# Altium project HnWrist.PrjPcb
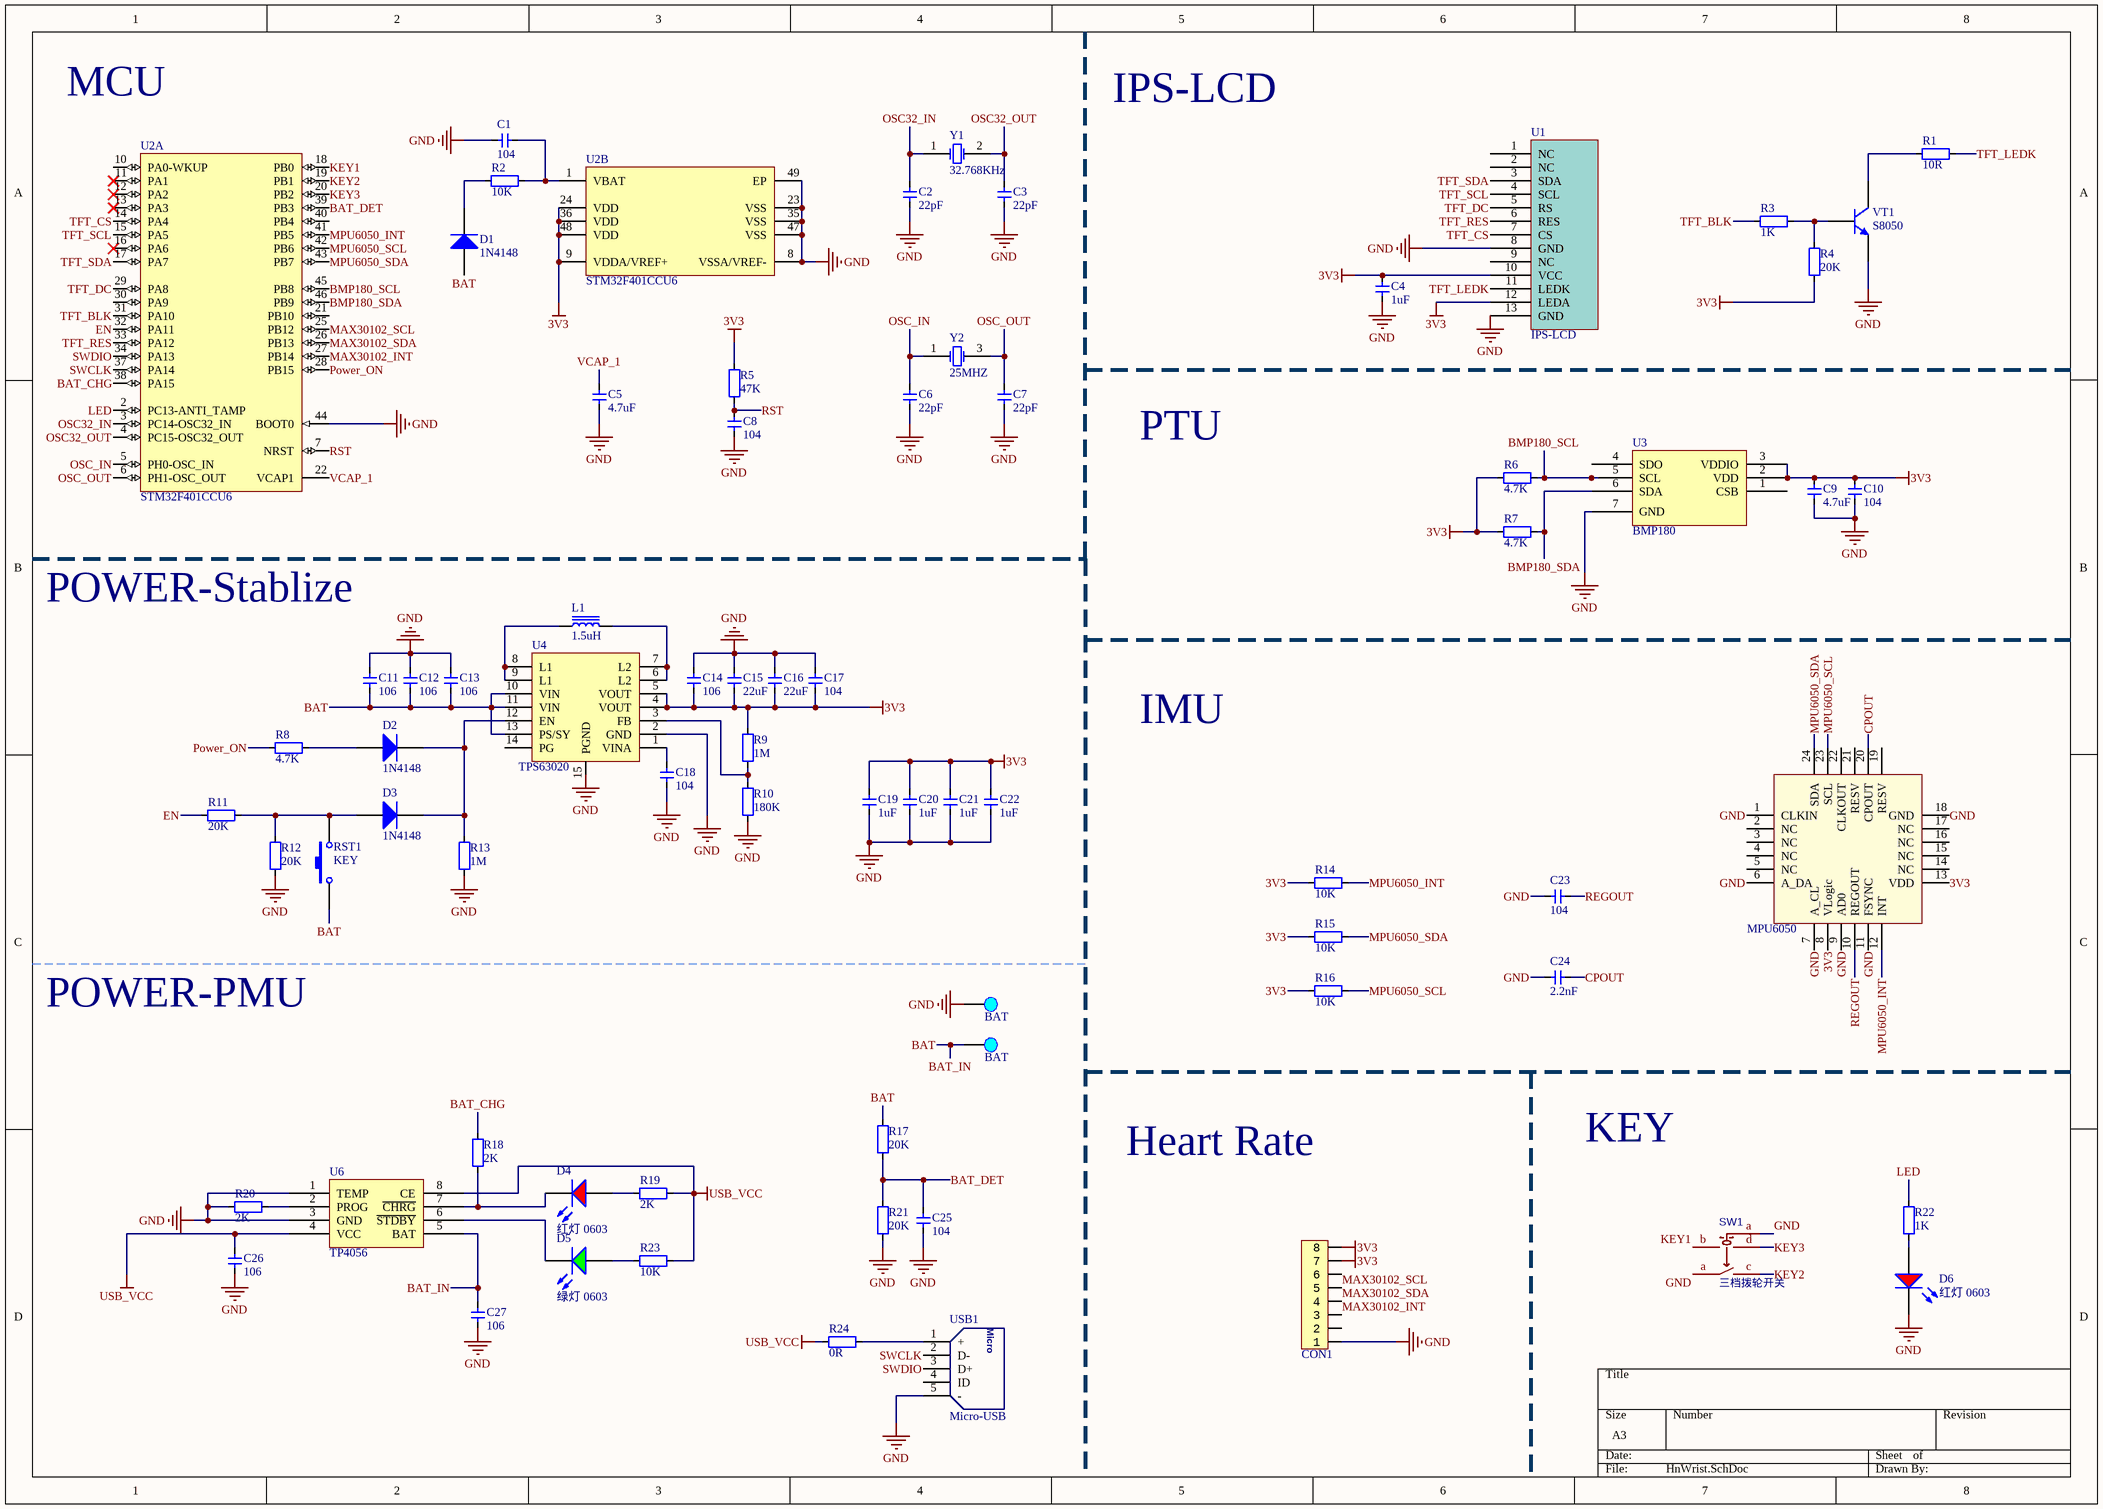
[diagram p0: HnWrist.SchDoc]
1 sheet, 73 parts. Net scope: global (net labels, ports and power ports of the same name join across sheets).
Board file: HnWrist.PcbDoc

## Sheet HnWrist.SchDoc
size A3; SheetNumber: 1; SheetTotal: 1

### Parts
C1  104  [CAP_0402]
C2  22pF  [CAP_0402]
C3  22pF  [CAP_0402]
C4  1uF  [CAP_0402]
C5  4.7uF  [CAP_0402]
C6  22pF  [CAP_0402]
C7  22pF  [CAP_0402]
C8  104  [CAP_0402]
C9  4.7uF  [CAP_0402]
C10  104  [CAP_0402]
C11  106  [CAP_0402]
C12  106  [CAP_0402]
C13  106  [CAP_0402]
C14  106  [CAP_0402]
C15  22uF  [CAP_0402]
C16  22uF  [CAP_0402]
C17  104  [CAP_0402]
C18  104  [CAP_0402]
C19  1uF  [CAP_0402]
C20  1uF  [CAP_0402]
C21  1uF  [CAP_0402]
C22  1uF  [CAP_0402]
C23  104  [CAP_0402]
C24  2.2nF  [CAP_0402]
C25  104  [CAP_0402]
C26  106  [CAP_0402]
C27  106  [CAP_0402]
CON1  MAX30102  [FFC_0.5_8]  (value not drawn)
D1  1N4148  [LC-SOD-323]
D2  1N4148  [LC-SOD-323]
D3  1N4148  [LC-SOD-323]
D4  红灯 0603  [LC-0603_LED_S1]
D5  绿灯 0603  [LC-0603_LED_S1]
D6  红灯 0603  [LC-0603_LED_S1]
L1  1.5uH  [变压器电感_0420]
Pad1  BAT  [Pad_A]
Pad2  BAT  [Pad_A]
R1  10R  [RES_0402]
R2  10K  [RES_0402]
R3  1K  [RES_0402]
R4  20K  [RES_0402]
R5  47K  [RES_0402]
R6  4.7K  [RES_0402]
R7  4.7K  [RES_0402]
R8  4.7K  [RES_0402]
R9  1M  [RES_0402]
R10  180K  [RES_0402]
R11  20K  [RES_0402]
R12  20K  [RES_0402]
R13  1M  [RES_0402]
R14  10K  [RES_0402]
R15  10K  [RES_0402]
R16  10K  [RES_0402]
R17  20K  [RES_0402]
R18  2K  [RES_0402]
R19  2K  [RES_0402]
R20  2K  [RES_0402]
R21  20K  [RES_0402]
R22  1K  [RES_0402]
R23  10K  [RES_0402]
R24  0R  [0603R]
RST1  KEY  [侧面按键3*6*3.5]
SW1  三档拨轮开关  [SW-SMD]
U1  IPS-LCD  [1.14IPS-LCD]
U2  STM32F401CCU6  [STM-UFQFPN48_N]  (parts A,B of 2)
U3  BMP180  [LGA-7]
U4  TPS63020  [TPS63020]
U5  MPU6050  [QFN-24]
U6  TP4056  [LC-SOP-8_EP_150mil]
USB1  Micro-USB  [USB-MICRO_A]
VT1  S8050  [SMT_TRIODE_NPN]
Y1  32.768KHz  [LC-SMD-3215_2P FC - 135]
Y2  25MHZ  [LC-SMD-3225_4P]

### Nets
3V3: C4.2 C9.2 C10.2 C14.1 C15.1 C16.1 C17.1 C19.1 C20.2 C21.2 C22.1 CON1.7 CON1.8 R4.2 R5.2 R6.2 R7.2 R9.1 R14.2 R15.2 R16.2 U1.10(VCC) U1.12(LEDA) U2.9(VDDA/VREF+) U2.24(VDD) U2.36(VDD) U2.48(VDD) U3.2(VDD) U3.3(VDDIO) U4.4(VOUT) U4.5(VOUT) U5.8(VLogic) U5.13(VDD)
GND: C1.1 C2.1 C3.1 C4.1 C5.1 C6.1 C7.1 C8.1 C9.1 C10.1 C11.2 C12.2 C13.2 C14.2 C15.2 C16.2 C17.2 C18.1 C19.2 C20.1 C21.1 C22.2 C23.1 C24.1 C25.2 C26.1 C27.1 CON1.1 D6.K Pad1.1 R10.2 R12.2 R13.2 R20.2 R21.2 SW1.a U1.8(GND) U1.13(GND) U2.8(VSSA/VREF-) U2.23(VSS) U2.35(VSS) U2.44(BOOT0) U2.47(VSS) U2.49(EP) U3.7(GND) U4.2(GND) U4.15(PGND) U5.1(CLKIN) U5.6(A_DA) U5.7(A_CL) U5.9(AD0) U5.11(FSYNC) U5.18(GND) U6.1(TEMP) U6.3(GND) USB1.5(-) VT1.2(E)
USB_VCC: C26.2 R19.2 R23.1 R24.2 U6.4(VCC) U6.8(CE)
BAT: C11.1 C12.1 C13.1 C27.2 D1.1(A) Pad2.1 R17.1 RST1.1 U4.10(VIN) U4.11(VIN) U4.13(PS/SY) U6.5(BAT)  [also labelled BAT_IN]
BAT_CHG: R18.1 U2.38(PA15)
BAT_DET: C25.1 R17.2 R21.1 U2.39(PB3)
BMP180_SCL: R6.1 U2.45(PB8) U3.5(SCL)
BMP180_SDA: R7.1 U2.46(PB9) U3.6(SDA)
CPOUT: C24.2 U5.20(CPOUT)
EN: R11.1 U2.32(PA11)
KEY1: SW1.b U2.18(PB0)
KEY2: SW1.c U2.19(PB1)
KEY3: SW1.d U2.20(PB2)
LED: R22.1 U2.2(PC13-ANTI_TAMP)
MAX30102_INT: CON1.3 U2.27(PB14)
MAX30102_SCL: CON1.5 U2.25(PB12)
MAX30102_SDA: CON1.4 U2.26(PB13)
MPU6050_INT: R14.1 U2.41(PB5) U5.12(INT)
MPU6050_SCL: R16.1 U2.42(PB6) U5.23(SCL)
MPU6050_SDA: R15.1 U2.43(PB7) U5.24(SDA)
OSC32_IN: C2.2 U2.3(PC14-OSC32_IN) Y1.1(OSC1)
OSC32_OUT: C3.2 U2.4(PC15-OSC32_OUT) Y1.2(OSC2)
OSC_IN: C6.2 U2.5(PH0-OSC_IN) Y2.1(OSC1)
OSC_OUT: C7.2 U2.6(PH1-OSC_OUT) Y2.3(OSC2)
Power_ON: R8.2 U2.28(PB15)
REGOUT: C23.2 U5.10(REGOUT)
RST: C8.2 R5.1 U2.7(NRST)
SWCLK: U2.37(PA14) USB1.2(D-)
SWDIO: U2.34(PA13) USB1.3(D+)
TFT_BLK: R3.2 U2.31(PA10)
TFT_CS: U1.7(CS) U2.14(PA4)
TFT_DC: U1.5(RS) U2.29(PA8)
TFT_LEDK: R1.1 U1.11(LEDK)
TFT_RES: U1.6(RES) U2.33(PA12)
TFT_SCL: U1.4(SCL) U2.15(PA5)
TFT_SDA: U1.3(SDA) U2.17(PA7)
VCAP_1: C5.2 U2.22(VCAP1)
NetC1_2: C1.2 R2.1 U2.1(VBAT)
NetC18_2: C18.2 U4.1(VINA)
NetD1_2: D1.2(K) R2.2
NetD2_1: D2.1(A) R8.1
NetD2_2: D2.2(K) D3.2(K) R13.1 U4.12(EN)
NetD3_1: D3.1(A) R11.2 R12.1 RST1.2
NetD4_A: D4.A R19.1
NetD4_K: D4.K R18.2 U6.7(~{CHRG})
NetD5_A: D5.A R23.2
NetD5_K: D5.K U6.6(~{STDBY})
NetD6_A: D6.A R22.2
NetL1_1: L1.1 U4.8(L1) U4.9(L1)
NetL1_2: L1.2 U4.6(L2) U4.7(L2)
NetR1_2: R1.2 VT1.3(C)
NetR3_1: R3.1 R4.1 VT1.1(B)
NetR9_2: R9.2 R10.1 U4.3(FB)
NetR20_1: R20.1 U6.2(PROG)
NetR24_1: R24.1 USB1.1(+)

Not connected (* = marked no-connect by the designer): CON1 2 6; U1 1(NC) 2(NC) 9(NC); U2 10(PA0-WKUP) 11(PA1)* 12(PA2)* 13(PA3)* 16(PA6)* 21(PB10) 30(PA9) 40(PB4); U3 1(CSB) 4(SDO); U4 14(PG); U5 2(NC) 3(NC) 4(NC) 5(NC) 14(NC) 15(NC) 16(NC) 17(NC) 19(RESV) 21(RESV) 22(CLKOUT); USB1 4(ID)

### Notes on the sheet
- MCU
- IPS-LCD
- PTU
- POWER-Stablize
- IMU
- POWER-PMU
- Heart Rate
- KEY
- (in symbol Micro-USB) Micro

### Library data of the parts
C1-C27 = 电容-0402: Capacitor; Value: 0.1u
CON1 = FFC_0.5_8: System: Connector
D1-D3 = SOD-323 1N4148WS T4: 二极管; ComponentLink1Description: 供应商链接; ComponentLink1URL: http://www.szlcsc.com/product/details_2485.html; Package: SOD-323; Supplier: LC; SuppliersPartNumber: C2128
D4 D6 = 0603 红灯: 发光二极管; ComponentLink1Description: 供应商链接; ComponentLink1URL: http://www.szlcsc.com/product/details_2659.html; Package: 0603; Supplier: LC; SuppliersPartNumber: C2286
D5 = 0603 绿灯: 发光二极管; ComponentLink1Description: 供应商链接; ComponentLink1URL: http://www.szlcsc.com/product/details_73152.html; Package: 0603; Supplier: LC; SuppliersPartNumber: C72043
L1 = Inductor Iron 2: _Current: 10A; _Accuracy: 20%; _Footprint: 1040; _Name: IND; _Specification: IND,1040,1.5uH,10A,20%; _Comma: ,; _Value: 1.5uH
Pad1 Pad2 = Pad: _Funcyusa: Test; _Specification: Pad,Test,BAT; _Comma: ,; _Name: Pad; _Remarks: BAT
R1-R24 = 电阻-0402: Resistor; Value: 22R
RST1 = SW-PB: 按键
SW1 = 拨轮开关: BOM_Manufacturer: XKB Enterprise; BOM_Manufacturer Part: TM-2022-3; Contributor: LCSC; BOM_Supplier: LCSC; BOM_Supplier Part: C318952; BOM_JLCPCB Part Class: Extended Part; spicePre: S; spiceSymbolName: TM-2022-3
U1 = IPS-LCD-1.14: IPS-LCD-1.14寸裸屏spi接口
U2 = STM32F401CCU6: ARM Cortex-M4 32-bit MCU+FPU, 105 DMIPS, 256 kB Flash, 64 kB Internal RAM, 36 I/Os, 48-pin UFQFPN, -40 to 85 degC, Tray; Manufacturer: STMicroelectronics; FLASH Size (Prog) (kB): 256; I/Os (High Current): 36; Internal RAM Size (kB): 64; Operating Frequency(F) (Processor speed) (MHz): 84; Supply Voltage(Vcc) max (V): 3.6; Supply Voltage(Vcc) min (V): 1.8; DatasheetVersion: Rev. 1; PackageVersion: Rev. 1, 04/2013; PackageReference: UFQFPN48; PackageDescription: 48-Pin Ultra Thin Fine Pitch Quad Flat No-Lead, 7 x 7 x 0.6 mm Body, 0.5 mm Pitch, Exposed Pad; Supplier 1: Newark; Supplier Part Number 1: 19X6217; Supplier 2: Mouser; Supplier Part Number 2: 511-STM32F401CCU6; Core: ARM Cortex-M4; Packing: Tray; Mounting Technology: Surface Mount; PartNumber: STM32F401CCU6; ComponentLink1Description: Manufacturer URL; ComponentLink1URL: http://www.st.com/web/en/home.html; ComponentLink2Description: Datasheet; ComponentLink2URL: http://www.st.com/st-web-ui/static/active/en/resource/technical/document/data_brief/DM00071938.pdf; ComponentLink3Description: Package Specification; ComponentLink3URL: http://www.st.com/st-web-ui/static/active/en/resource/technical/document/data_brief/DM00071938.pdf
U3 = BMP180: 数字气压传感器
U5 = MPU6050: 六轴传感器
U6 = TP4056: 电池电源管理; ComponentLink1Description: 供应商链接; ComponentLink1URL: http://www.szlcsc.com/product/details_17264.html; Package: SOP-8_EP_150mil; Supplier: LC; SuppliersPartNumber: C16581
VT1 = SMT_TRIODE_NPN: Surface mount NPN transistor, package SOT-23
Y1 = SMD-3215_2P 32.768KHz 20ppm 12.5pF: 贴片晶振; ComponentLink1Description: 供应商链接; ComponentLink1URL: http://www.szlcsc.com/product/details_33310.html; Package: SMD-3215_2P; Supplier: LC; SuppliersPartNumber: C32346
Y2 = SMD-3225_4P  25MHZ 12PF 10PPM: 贴片晶振; ComponentLink1Description: 供应商链接; ComponentLink1URL: http://www.szlcsc.com/product/details_9526.html; Package: SMD-3225_4P; Supplier: LC; SuppliersPartNumber: C9006